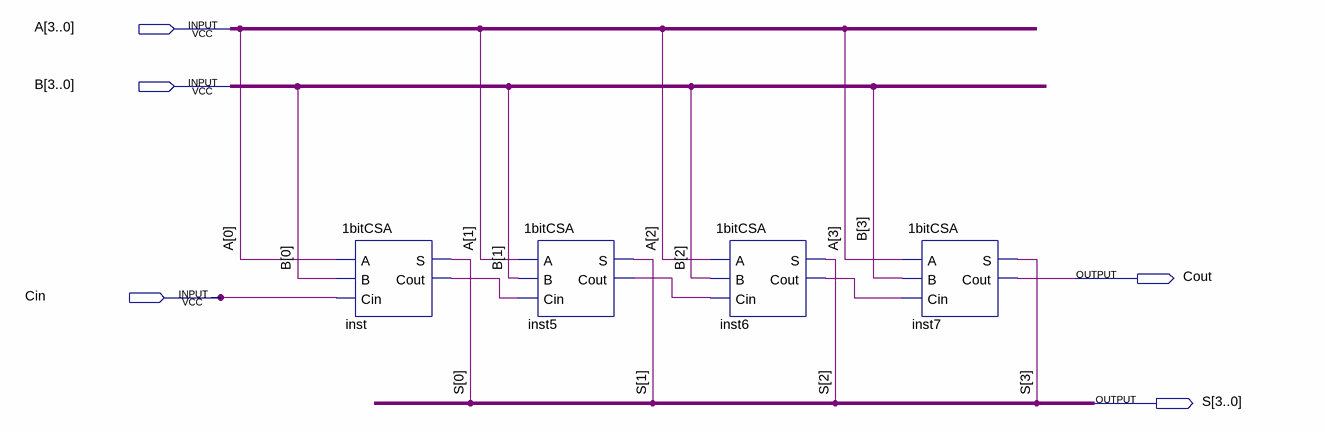
[diagram p0: schematic sheet]
// Quartus schematic 4bitCSA.bdf as structural Verilog: 4 symbols, 5 pins
module \4bitCSA  (
  input  [3:0] A,
  input  [3:0] B,
  input  Cin,
  output Cout,
  output [3:0] S
);

  wire inst5_cout, inst6_cout, inst_cout;

  \1bitCSA  inst (.A(A[0]), .B(B[0]), .Cin(Cin), .S(S[0]), .Cout(inst_cout));
  \1bitCSA  inst5 (.A(A[1]), .B(B[1]), .Cin(inst_cout), .S(S[1]), .Cout(inst5_cout));
  \1bitCSA  inst6 (.A(A[2]), .B(B[2]), .Cin(inst5_cout), .S(S[2]), .Cout(inst6_cout));
  \1bitCSA  inst7 (.A(A[3]), .B(B[3]), .Cin(inst6_cout), .S(S[3]), .Cout(Cout));
endmodule
